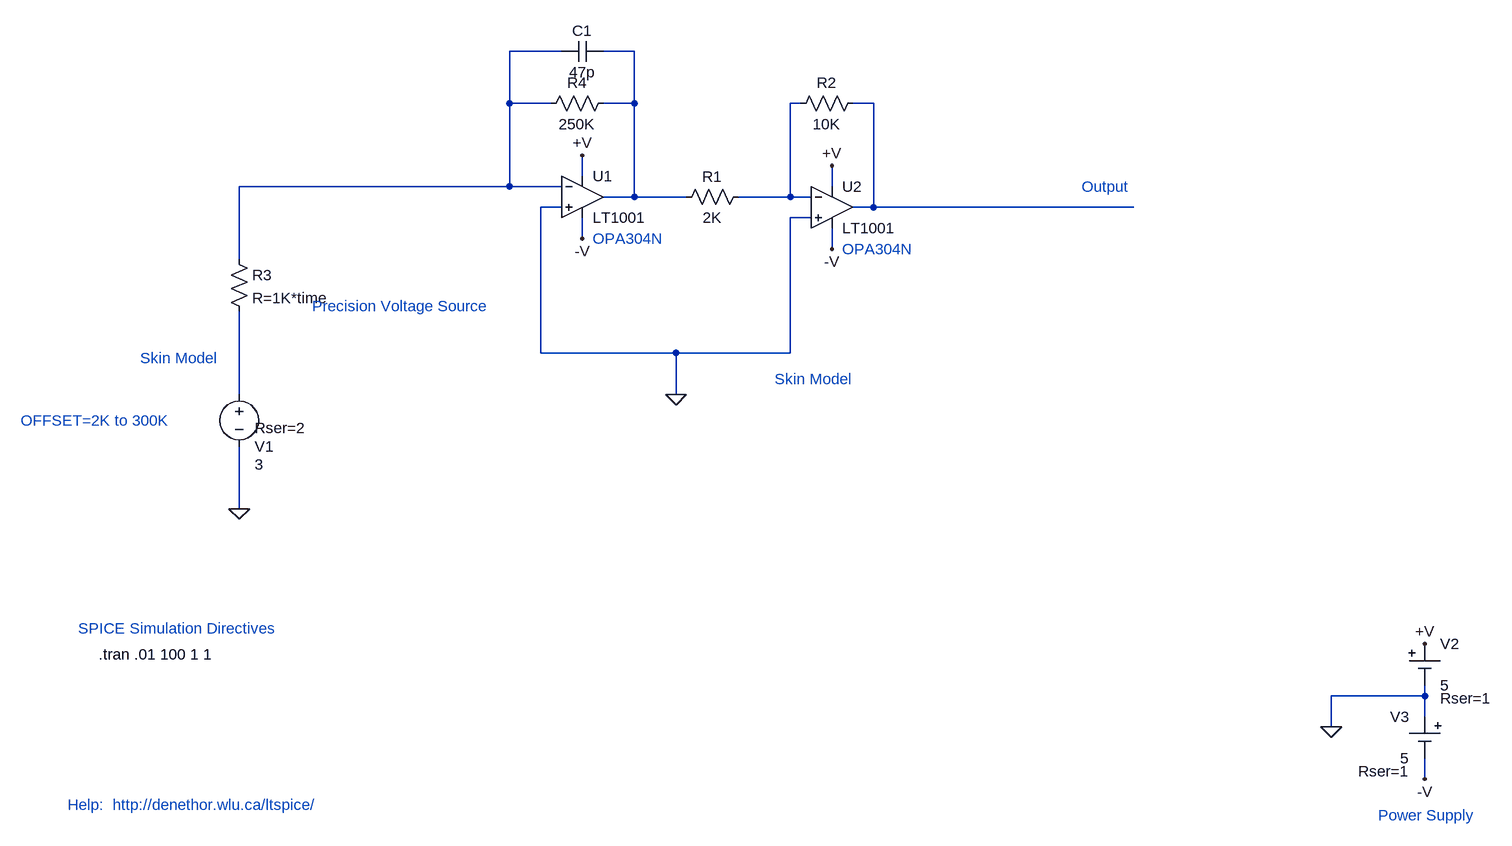
[diagram p0: schematic GSR3.asc]
GSR3.asc, the LTspice schematic file:
Version 4
SHEET 1 1356 1016
WIRE -592 -304 -672 -304
WIRE -480 -304 -528 -304
WIRE -672 -224 -672 -304
WIRE -608 -224 -672 -224
WIRE -480 -224 -480 -304
WIRE -480 -224 -528 -224
WIRE -224 -224 -240 -224
WIRE -112 -224 -144 -224
WIRE -560 -112 -560 -144
WIRE -672 -96 -672 -224
WIRE -672 -96 -1088 -96
WIRE -592 -96 -672 -96
WIRE -176 -96 -176 -128
WIRE -480 -80 -480 -224
WIRE -480 -80 -528 -80
WIRE -400 -80 -480 -80
WIRE -240 -80 -240 -224
WIRE -240 -80 -320 -80
WIRE -208 -80 -240 -80
WIRE -592 -64 -624 -64
WIRE -112 -64 -112 -224
WIRE -112 -64 -144 -64
WIRE 288 -64 -112 -64
WIRE -208 -48 -240 -48
WIRE -560 -16 -560 -48
WIRE -176 0 -176 -32
WIRE -1088 16 -1088 -96
WIRE -624 160 -624 -64
WIRE -416 160 -624 160
WIRE -240 160 -240 -48
WIRE -240 160 -416 160
WIRE -1088 224 -1088 96
WIRE -416 224 -416 160
WIRE -1088 400 -1088 304
WIRE 736 688 736 672
WIRE 736 688 592 688
WIRE 736 720 736 688
WIRE 592 736 592 688
WIRE 736 816 736 784
FLAG 736 608 +V
FLAG 736 816 -V
FLAG 592 736 0
FLAG -176 0 -V
FLAG -176 -128 +V
FLAG -1088 400 0
FLAG -560 -16 -V
FLAG -560 -144 +V
FLAG -416 224 0
SYMBOL Opamps\\LT1001 -176 -128 R0
SYMATTR InstName U2
SYMBOL Misc\\cell 736 608 R0
WINDOW 123 0 0 Left 2
WINDOW 39 24 84 Left 2
SYMATTR SpiceLine Rser=1
SYMATTR InstName V2
SYMATTR Value 5
SYMBOL Misc\\cell 736 720 M0
WINDOW 123 0 0 Left 2
WINDOW 39 24 84 Left 2
SYMATTR SpiceLine Rser=1
SYMATTR InstName V3
SYMATTR Value 5
SYMBOL res -1104 0 R0
SYMATTR InstName R3
SYMATTR Value R=1K*time
SYMBOL Opamps\\LT1001 -560 -144 R0
SYMATTR InstName U1
SYMBOL voltage -1088 208 R0
WINDOW 0 24 96 Left 2
WINDOW 3 24 124 Left 2
WINDOW 39 24 68 Left 2
WINDOW 123 0 0 Left 2
SYMATTR InstName V1
SYMATTR Value 3
SYMATTR SpiceLine Rser=2
SYMBOL res -304 -96 R90
WINDOW 0 0 56 VBottom 2
WINDOW 3 32 56 VTop 2
SYMATTR InstName R1
SYMATTR Value 2K
SYMBOL res -128 -240 R90
WINDOW 0 0 56 VBottom 2
WINDOW 3 32 56 VTop 2
SYMATTR InstName R2
SYMATTR Value 10K
SYMBOL res -512 -240 R90
WINDOW 0 0 56 VBottom 2
WINDOW 3 32 56 VTop 2
SYMATTR InstName R4
SYMATTR Value 250K
SYMBOL cap -528 -320 R90
WINDOW 0 0 32 VBottom 2
WINDOW 3 32 32 VTop 2
SYMATTR InstName C1
SYMATTR Value 47p
TEXT -1352 856 Left 2 ;Help:  http://denethor.wlu.ca/ltspice/
TEXT -1336 584 Left 2 ;SPICE Simulation Directives
TEXT -1304 624 Left 2 !.tran .01 100 1 1
TEXT -264 200 Left 2 ;Skin Model
TEXT -976 88 Left 2 ;Precision Voltage Source
TEXT -160 0 Left 2 ;OPA304N
TEXT 208 -96 Left 2 ;Output
TEXT 664 872 Left 2 ;Power Supply
TEXT -1240 168 Left 2 ;Skin Model
TEXT -1424 264 Left 2 ;OFFSET=2K to 300K
TEXT -544 -16 Left 2 ;OPA304N

The netlist it stands for:
* GSR3.asc
XU2 0 N003 +V -V N004 LT1001  ; pins In+ In- V+ V- OUT
V2 +V 0 5 Rser=1
V3 0 -V 5 Rser=1
R3 N001 N005 R=1K*time
XU1 0 N001 +V -V N002 LT1001  ; pins In+ In- V+ V- OUT
V1 N005 0 3 Rser=2
R1 N003 N002 2K
R2 N004 N003 10K
R4 N002 N001 250K
C1 N002 N001 47p
* Help:  http://denethor.wlu.ca/ltspice/
* SPICE Simulation Directives
.tran .01 100 1 1
* Skin Model
* Precision Voltage Source
* OPA304N
* Output
* Power Supply
* Skin Model
* OFFSET=2K to 300K
* OPA304N
.lib LTC.lib
.backanno
.end